# Altium project QUTMS-TSAL-V00.PrjPcb
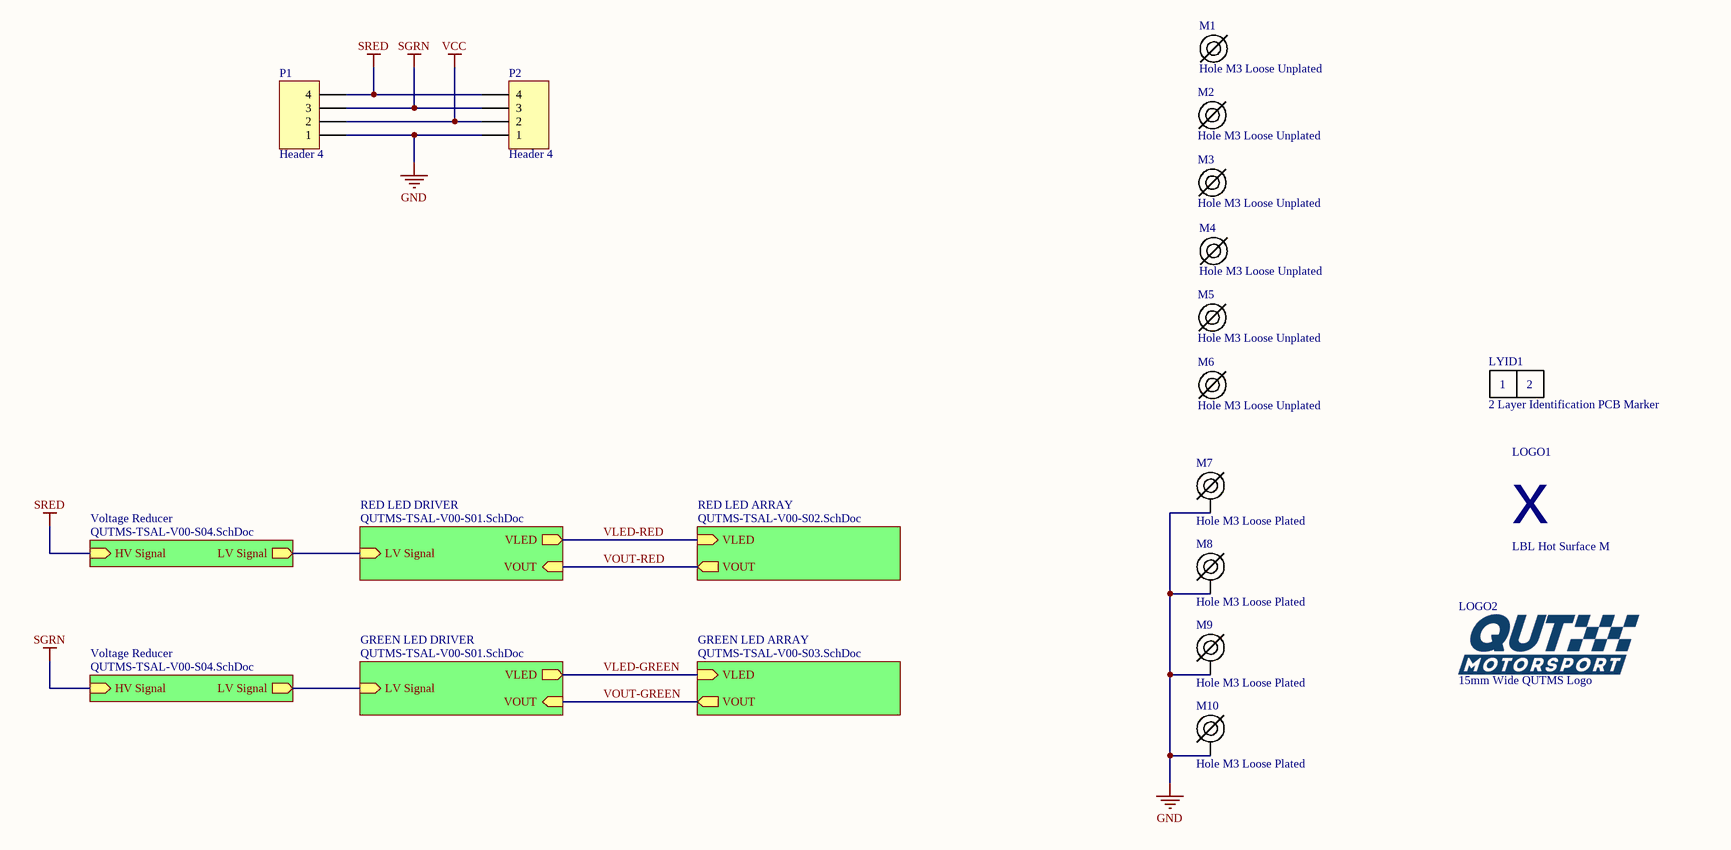
[diagram p0: QUTMS-TSAL-V00-S00.SchDoc]
3 sheets, 22 parts. Net scope: hierarchical (ports join the sheet entries above them; power ports are global).
Board file: QUTMS-TSAL-V01-B00.PcbDoc
Sheets:
  QUTMS-TSAL-V00-S00.SchDoc
    GREEN LED ARRAY = QUTMS-TSAL-V00-S03.SchDoc
    Voltage Reducer = QUTMS-TSAL-V00-S04.SchDoc
    Voltage Reducer = QUTMS-TSAL-V00-S04.SchDoc

## Sheet QUTMS-TSAL-V00-S00.SchDoc: Tractive System Active Light - TSAL
size A3; DrawnBy: Joseph Richards; DocumentNumber: 1; Revision: 1; SheetNumber: 1; SheetTotal: 5

### Parts
LOGO1  LBL Hot Surface M  [LBL HOT MEDIUM]
LOGO2  15mm Wide QUTMS Logo  [QUTMS LOGO 15MM]
LYID1  2 Layer Identification PCB Marker  [LAYER IDENT 2]
M1  Hole M3 Loose Unplated  [M3.5 UNPLATED]
M2  Hole M3 Loose Unplated  [M3.5 UNPLATED]
M3  Hole M3 Loose Unplated  [M3.5 UNPLATED]
M4  Hole M3 Loose Unplated  [M3.5 UNPLATED]
M5  Hole M3 Loose Unplated  [M3.5 UNPLATED]
M6  Hole M3 Loose Unplated  [M3.5 UNPLATED]
M7  Hole M3 Loose Plated  [M3.5 PLATED]
M8  Hole M3 Loose Plated  [M3.5 PLATED]
M9  Hole M3 Loose Plated  [M3.5 PLATED]
M10  Hole M3 Loose Plated  [M3.5 PLATED]
P1  Header 4  [HDR1X4]
P2  Header 4  [HDR1X4]

### Sub-sheets
GREEN LED ARRAY = QUTMS-TSAL-V00-S03.SchDoc: VOUT (out), VLED (in)
GREEN LED DRIVER = QUTMS-TSAL-V00-S01.SchDoc (file not in this document): VLED (out), VOUT (in), LV Signal (in)
RED LED ARRAY = QUTMS-TSAL-V00-S02.SchDoc (file not in this document): VOUT (out), VLED (in)
RED LED DRIVER = QUTMS-TSAL-V00-S01.SchDoc (file not in this document): VLED (out), VOUT (in), LV Signal (in)
Voltage Reducer = QUTMS-TSAL-V00-S04.SchDoc: HV Signal (in), LV Signal (out)
Voltage Reducer = QUTMS-TSAL-V00-S04.SchDoc: HV Signal (in), LV Signal (out)

### Nets
GND: M7.1 M8.1 M9.1 M10.1 P1.1 P2.1
SGRN: P1.3 P2.3 ; sheet Voltage Reducer/HV Signal
SRED: P1.4 P2.4 ; sheet Voltage Reducer/HV Signal
VCC: P1.2 P2.2
VLED-GREEN: sheet GREEN LED ARRAY/VLED, sheet GREEN LED DRIVER/VLED
VLED-RED: sheet RED LED DRIVER/VLED, sheet RED LED ARRAY/VLED
VOUT-GREEN: sheet GREEN LED ARRAY/VOUT, sheet GREEN LED DRIVER/VOUT
VOUT-RED: sheet RED LED DRIVER/VOUT, sheet RED LED ARRAY/VOUT
NetD2A_K: sheet GREEN LED DRIVER/LV Signal, sheet Voltage Reducer/LV Signal
NetD2B_K: sheet RED LED DRIVER/LV Signal, sheet Voltage Reducer/LV Signal

### Notes on the sheet
- Revision History:
- Sheet Title:
- Rev
- Date
- Description
- Project:
- Size:
- Drawn By:
- A3
- Number:
- Revision:
- Sheet
- Version:
- of
- QUT Motorsport
- O-120, Gardens Point
- 2 George Street
- Brisbane, QLD 4000
- Australia
- Print Date:
- Print Time:
- File Name:
- (in symbol Layer Identification 2) 1; 2
- (in symbol LBL Hot Surface M) x

### Library data of the parts
LOGO2 = QUTMS Logo 15mm
LYID1 = Layer Identification 2
M1-M6 = Hole M3 Loose Unplated: M3.5 Hole, No Plating
M7-M10 = Hole M3 Loose Plated: M3.5 Hole, Plated
P1 P2 = Header 4: Header, 4-Pin; LatestRevisionDate: 17-Jul-2002; LatestRevisionNote: Re-released for DXP Platform.; Publisher: Altium Limited

## Sheet QUTMS-TSAL-V00-S03.SchDoc: Green LED Array
size A3; DrawnBy: Joseph Richards; DocumentNumber: 4; Revision: 1; SheetNumber: 4; SheetTotal: 5
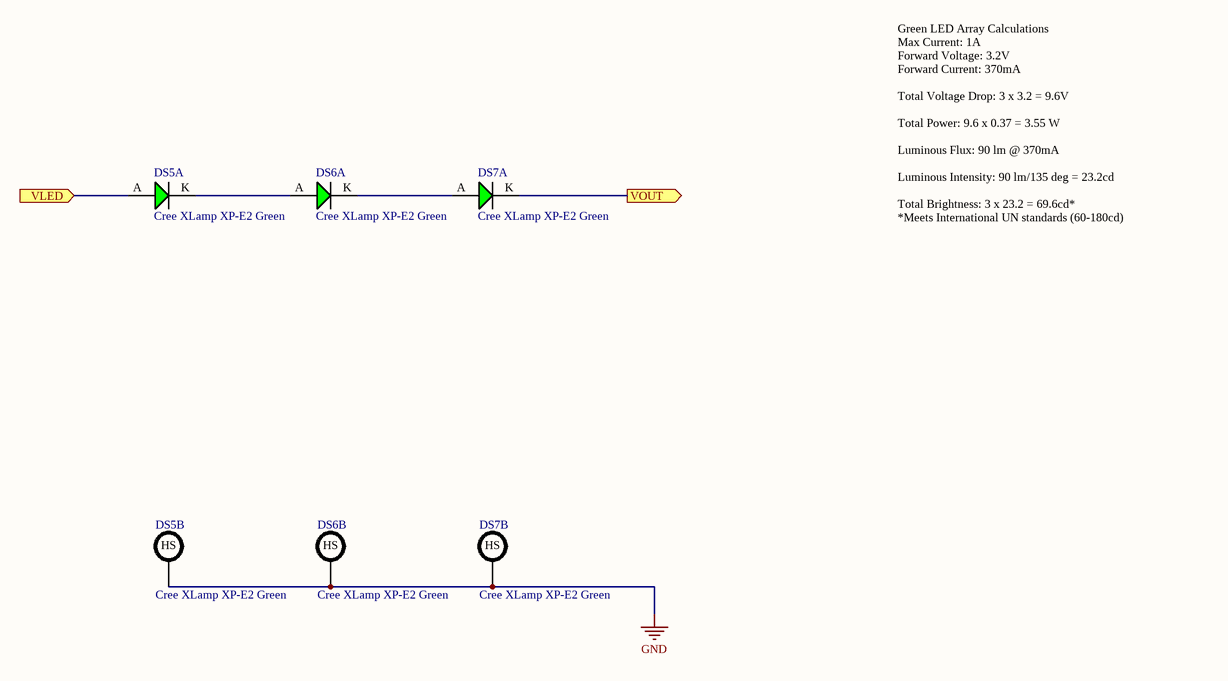
[diagram p1: QUTMS-TSAL-V00-S03.SchDoc]

### Parts
DS5  Cree XLamp XP-E2 Green  [Cree XLamp XP-E2]  (parts A,B of 2)
DS6  Cree XLamp XP-E2 Green  [Cree XLamp XP-E2]  (parts A,B of 2)
DS7  Cree XLamp XP-E2 Green  [Cree XLamp XP-E2]  (parts A,B of 2)

### Ports
VLED (in), VOUT (out)

### Nets
GND: DS5.HS DS6.HS DS7.HS
VLED-GREEN: DS5.A ; port VLED
VOUT-GREEN: DS7.K ; port VOUT
NetDS5_K: DS5.K DS6.A
NetDS6_K: DS6.K DS7.A

### Notes on the sheet
- Green LED Array Calculations
  Max Current: 1A
  Forward Voltage: 3.2V
  Forward Current: 370mA
  Total Voltage Drop: 3 x 3.2 = 9.6V
  Total Power: 9.6 x 0.37 = 3.55 W
  Luminous Flux: 90 lm @ 370mA
  Luminous Intensity: 90 lm/135 deg = 23.2cd
  Total Brightness: 3 x 23.2 = 69.6cd*
  *Meets International UN standards (60-180cd)
- Revision History:
- Sheet Title:
- Rev
- Date
- Description
- Project:
- Size:
- Drawn By:
- A3
- Number:
- Revision:
- Sheet
- Version:
- of
- QUT Motorsport
- O-120, Gardens Point
- 2 George Street
- Brisbane, QLD 4000
- Australia
- Print Date:
- Print Time:
- File Name:

### Library data of the parts
DS5-DS7 = Cree XLamp XP-E2 Green: XPEBGR-L1-0000-00A01 -  High Brightness LED, XLamp XP-E2 Series, Green, 535 nm, 135 °, 87.4 lm, 1 A; ComponentLink1Description: Element14; ComponentLink1URL: https://au.element14.com/cree/xpebrd-l1-0000-00601/led-smd-xlamp-xpe-e-red-62lm/dp/2335107

## Sheet QUTMS-TSAL-V00-S04.SchDoc: Zener Voltage Regulator
size A3; DrawnBy: Joseph Richards; DocumentNumber: 5; Revision: 1; SheetNumber: 5; SheetTotal: 5
Used 2 times, as channels Voltage Reducer, Voltage Reducer. Parts and nets are listed once, with the designators drawn on the sheet.
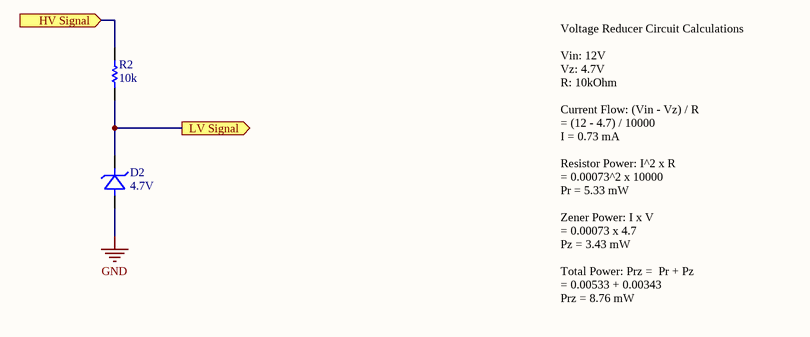
[diagram p2: QUTMS-TSAL-V00-S04.SchDoc]

### Parts
D2  4.7V  [SOD123]
R2  10k  [Res_ThinFilm_0603]

### Ports
HV Signal (in), LV Signal (out)

### Nets
GND: D2.A(Anode)
HV Signal: R2.2 ; port HV Signal
LV Signal: D2.K(Cathode) R2.1 ; port LV Signal

### Channels
Voltage Reducer: designators end in B; ports HV Signal=SRED LV Signal=NetD2B_K
Voltage Reducer: designators end in A; ports HV Signal=SGRN LV Signal=NetD2A_K

### Notes on the sheet
- Voltage Reducer Circuit Calculations
  Vin: 12V
  Vz: 4.7V
  R: 10kOhm
  Current Flow: (Vin - Vz) / R
  = (12 - 4.7) / 10000
  I = 0.73 mA
  Resistor Power: I^2 x R
  = 0.00073^2 x 10000
  Pr = 5.33 mW
  Zener Power: I x V
  = 0.00073 x 4.7
  Pz = 3.43 mW
  Total Power: Prz =  Pr + Pz
  = 0.00533 + 0.00343
  Prz = 8.76 mW
- Revision History:
- Sheet Title:
- Rev
- Date
- Description
- Project:
- Size:
- Drawn By:
- A3
- Number:
- Revision:
- Sheet
- Version:
- of
- QUT Motorsport
- O-120, Gardens Point
- 2 George Street
- Brisbane, QLD 4000
- Australia
- Print Date:
- Print Time:
- File Name:

### Library data of the parts
D2 = MMSZ4688T1G: MMSZ4688T1G -  Zener Single Diode, 4.7 V, 500 mW, SOD-123, 5 %, 2 Pins, 150 °C; ComponentLink1Description: Element14; ComponentLink1URL: https://au.element14.com/on-semiconductor/mmsz4688t1g/zener-voltage-vz-typ-4-7v/dp/1459118
R2 = 10k 5% 0603: Resistor, SMD, 10k, 0.1W, 5%, 0603

## Nets that join several sheets
GND: QUTMS-TSAL-V00-S00 (6 pins), QUTMS-TSAL-V00-S03 (DS5.HS DS6.HS DS7.HS), Voltage Reducer (D2B.A), Voltage Reducer (D2A.A)
SGRN: QUTMS-TSAL-V00-S00 (P1.3 P2.3), Voltage Reducer (R2A.2)
SRED: QUTMS-TSAL-V00-S00 (P1.4 P2.4), Voltage Reducer (R2B.2)